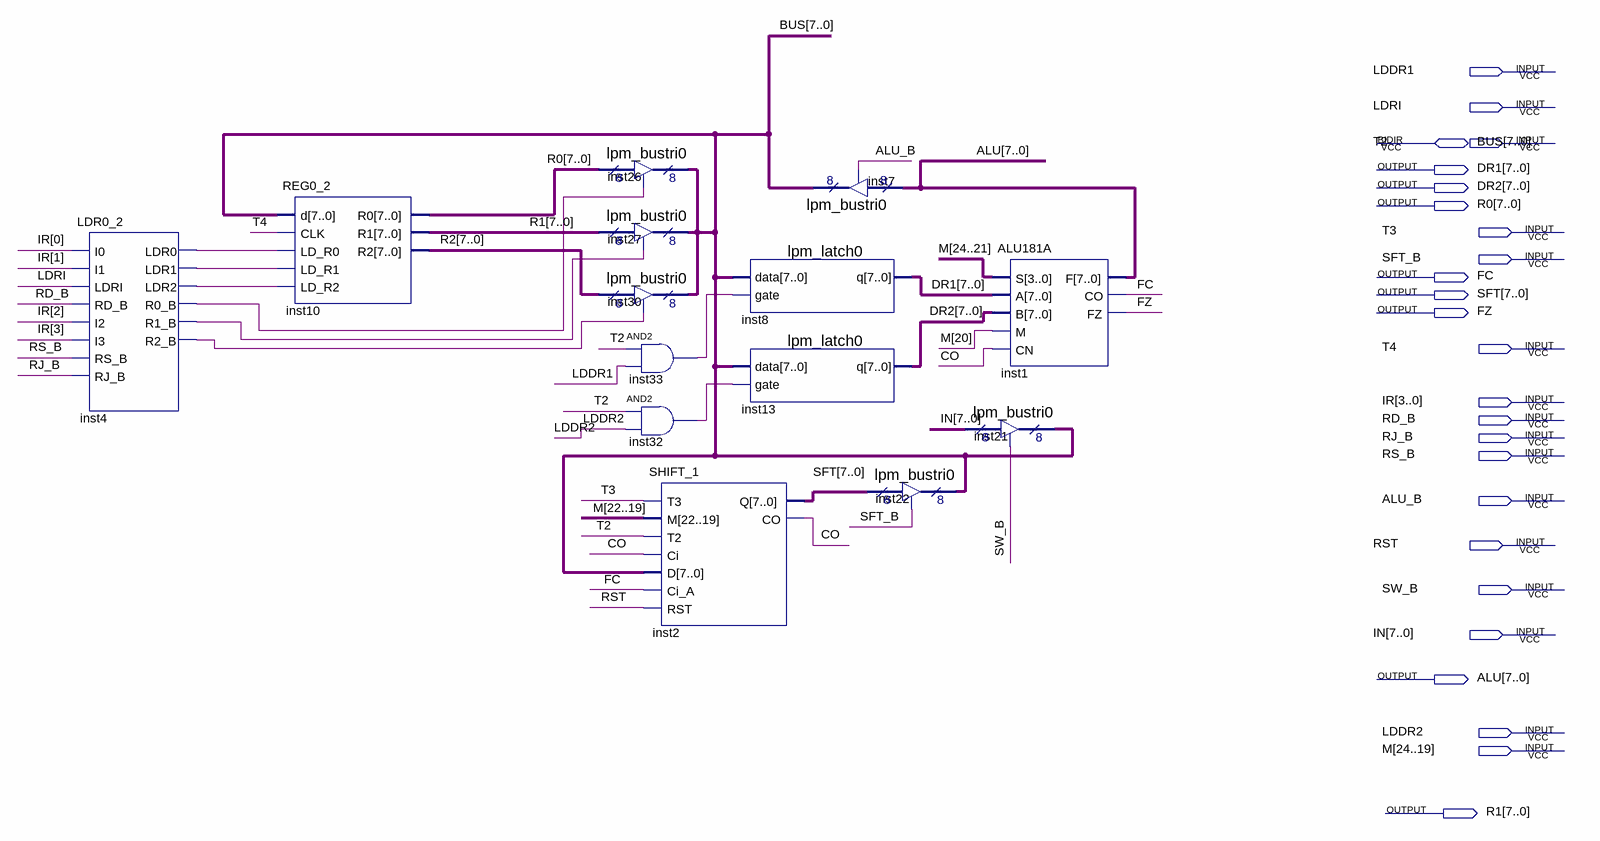
[diagram p0: schematic sheet]
// Quartus schematic ALU_MD2.bdf as structural Verilog: 14 symbols, 25 pins
module ALU_MD2 (
  input  LDDR1,
  input  LDRI,
  input  T2,
  input  T3,
  input  SFT_B,
  input  T4,
  input  [3:0] IR,
  input  RD_B,
  input  RJ_B,
  input  RS_B,
  input  ALU_B,
  input  RST,
  input  SW_B,
  input  [7:0] IN,
  input  LDDR2,
  input  [24:19] M,
  inout  [7:0] BUS,
  output [7:0] DR1,
  output [7:0] DR2,
  output [7:0] R0,
  output FC,
  output [7:0] SFT,
  output FZ,
  output [7:0] ALU,
  output [7:0] R1
);

  wire CO, inst4_ldr0, inst4_ldr1, inst4_ldr2, inst4_r0_b, inst4_r1_b, inst4_r2_b, inst32_out, inst33_out;
  wire [7:0] R2;

  LDR0_2 inst4 (
    .I0(IR[0]), .I1(IR[1]), .LDRI(LDRI), .RD_B(RD_B), .I2(IR[2]), .I3(IR[3]), .RS_B(RS_B), .RJ_B(RJ_B),
    .LDR0(inst4_ldr0), .LDR1(inst4_ldr1), .LDR2(inst4_ldr2), .R0_B(inst4_r0_b), .R1_B(inst4_r1_b),
    .R2_B(inst4_r2_b));
  REG0_2 inst10 (
    .d(BUS), .CLK(T4), .LD_R0(inst4_ldr0), .LD_R1(inst4_ldr1), .LD_R2(inst4_ldr2), .R0(R0), .R1(R1), .R2(R2));
  lpm_bustri0 inst26 (.enabledt(inst4_r0_b), .data(R0), .tridata(BUS));
  lpm_bustri0 inst27 (.enabledt(inst4_r1_b), .data(R1), .tridata(BUS));
  lpm_bustri0 inst30 (.enabledt(inst4_r2_b), .data(R2), .tridata(BUS));
  and inst33 (inst33_out, T2, LDDR1);
  and inst32 (inst32_out, T2, LDDR2);
  SHIFT_1 inst2 (.T3(T3), .M(M[22:19]), .T2(T2), .Ci(CO), .D(BUS), .Ci_A(FC), .RST(RST), .Q(SFT), .CO(CO));
  lpm_latch0 inst8 (.data(BUS), .gate(inst33_out), .q(DR1));
  lpm_latch0 inst13 (.data(BUS), .gate(inst32_out), .q(DR2));
  lpm_bustri0 inst7 (.enabledt(ALU_B), .data(ALU), .tridata(BUS));
  lpm_bustri0 inst22 (.enabledt(SFT_B), .data(SFT), .tridata(BUS));
  lpm_bustri0 inst21 (.enabledt(SW_B), .data(IN), .tridata(BUS));
  ALU181A inst1 (.S(M[24:21]), .A(DR1), .B(DR2), .M(M[20]), .CN(CO), .F(ALU), .CO(FC), .FZ(FZ));
endmodule
